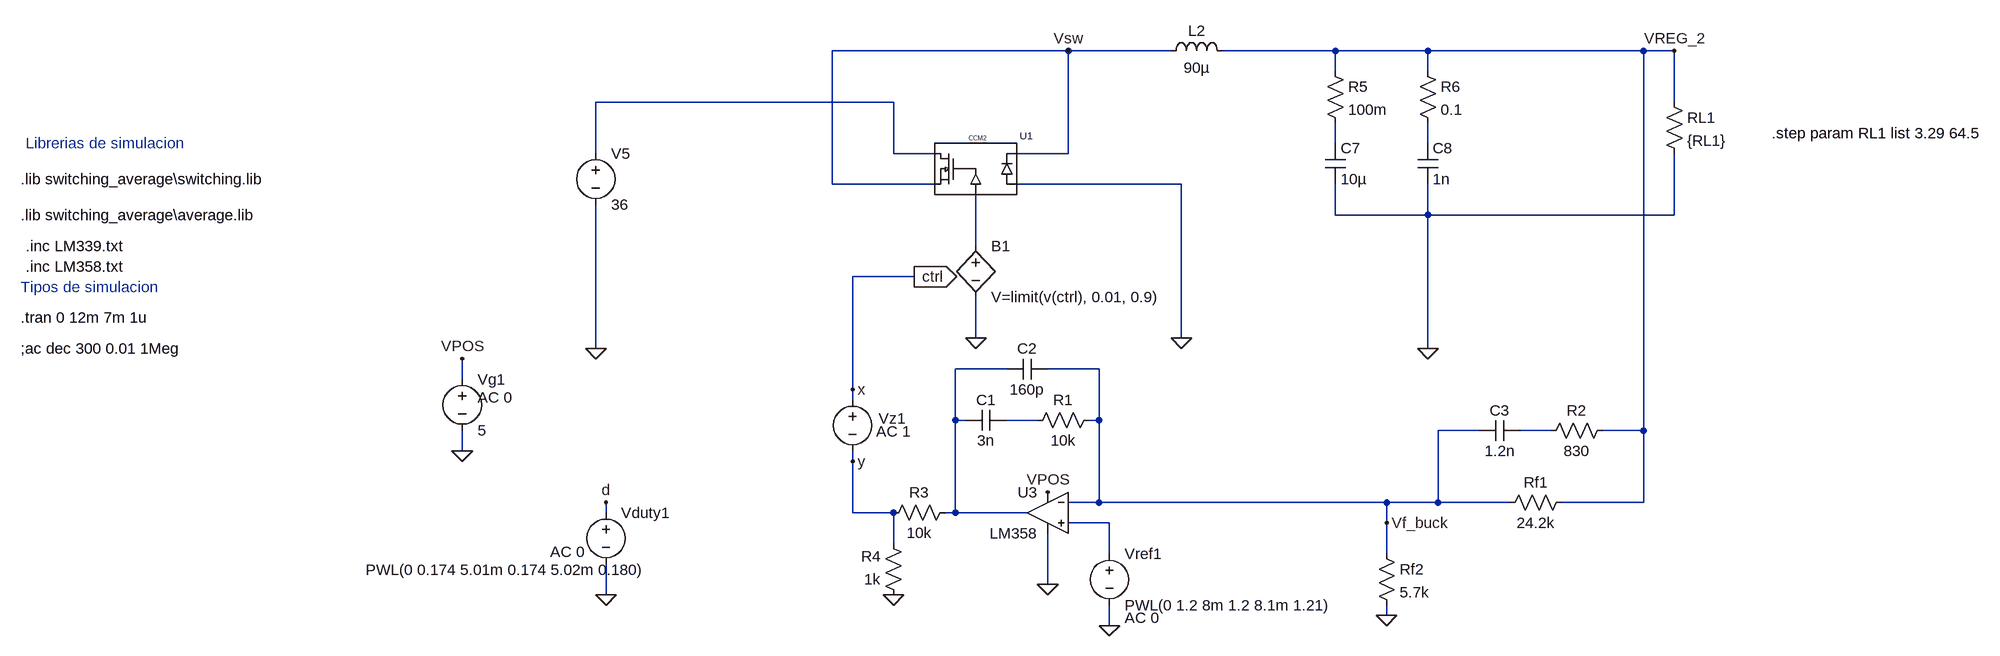
[diagram p0: schematic BUCK_v4_average.asc]
BUCK_v4_average.asc, the LTspice schematic file:
Version 4
SHEET 1 1932 1700
WIRE -688 576 -1056 576
WIRE -528 576 -688 576
WIRE -272 576 -448 576
WIRE -128 576 -272 576
WIRE 208 576 -128 576
WIRE 256 576 208 576
WIRE -272 608 -272 576
WIRE -128 608 -128 576
WIRE -960 656 -1424 656
WIRE 256 656 256 576
WIRE -272 720 -272 688
WIRE -128 720 -128 688
WIRE -1424 736 -1424 656
WIRE -960 736 -960 656
WIRE -896 736 -960 736
WIRE -688 736 -688 576
WIRE -688 736 -768 736
WIRE -1056 784 -1056 576
WIRE -896 784 -1056 784
WIRE -512 784 -768 784
WIRE -272 832 -272 784
WIRE -128 832 -128 784
WIRE -128 832 -272 832
WIRE 256 832 256 736
WIRE 256 832 -128 832
WIRE -832 880 -832 800
WIRE -928 928 -1024 928
WIRE -832 1024 -832 960
WIRE -512 1024 -512 784
WIRE -1424 1040 -1424 816
WIRE -128 1040 -128 832
WIRE -784 1072 -864 1072
WIRE -640 1072 -720 1072
WIRE -1632 1088 -1632 1056
WIRE -1024 1104 -1024 928
WIRE -1024 1120 -1024 1104
WIRE -864 1152 -864 1072
WIRE -848 1152 -864 1152
WIRE -736 1152 -784 1152
WIRE -640 1152 -640 1072
WIRE -640 1152 -656 1152
WIRE -48 1168 -112 1168
WIRE 64 1168 16 1168
WIRE 208 1168 208 576
WIRE 208 1168 144 1168
WIRE -1632 1200 -1632 1168
WIRE -1024 1216 -1024 1200
WIRE -640 1280 -640 1152
WIRE -640 1280 -688 1280
WIRE -192 1280 -640 1280
WIRE -112 1280 -112 1168
WIRE -112 1280 -192 1280
WIRE 0 1280 -112 1280
WIRE 208 1280 208 1168
WIRE 208 1280 80 1280
WIRE -1408 1296 -1408 1280
WIRE -1024 1296 -1024 1216
WIRE -960 1296 -1024 1296
WIRE -864 1296 -864 1152
WIRE -864 1296 -880 1296
WIRE -752 1296 -864 1296
WIRE -624 1312 -688 1312
WIRE -192 1312 -192 1280
WIRE -960 1344 -960 1296
WIRE -624 1360 -624 1312
WIRE -192 1360 -192 1312
WIRE -720 1408 -720 1328
WIRE -1408 1424 -1408 1376
WIRE -192 1456 -192 1440
WIRE -624 1472 -624 1440
FLAG -1408 1424 0
FLAG -1408 1280 d
FLAG -1424 1040 0
FLAG 256 576 VREG_2
FLAG -512 1024 0
FLAG -128 1040 0
FLAG -688 576 Vsw
FLAG -192 1456 0
FLAG -720 1408 0
FLAG -624 1472 0
FLAG -832 1024 0
FLAG -928 928 ctrl
IOPIN -928 928 Out
FLAG -1024 1104 x
FLAG -1024 1216 y
FLAG -192 1312 Vf_buck
FLAG -1632 1200 0
FLAG -720 1264 VPOS
FLAG -1632 1056 VPOS
FLAG -960 1424 0
SYMBOL voltage -1408 1280 R0
WINDOW 3 -374 105 Left 2
WINDOW 123 -87 77 Left 2
WINDOW 39 0 0 Left 2
SYMATTR Value PWL(0 0.174 5.01m 0.174 5.02m 0.180)
SYMATTR Value2 AC 0
SYMATTR InstName Vduty1
SYMBOL voltage -1424 720 R0
WINDOW 123 0 0 Left 0
WINDOW 39 0 0 Left 0
SYMATTR InstName V5
SYMATTR Value 36
SYMBOL ind -544 592 R270
WINDOW 0 32 56 VTop 2
WINDOW 3 5 56 VBottom 2
SYMATTR InstName L2
SYMATTR Value 90µ
SYMBOL cap -288 720 R0
SYMATTR InstName C7
SYMATTR Value 10µ
SYMBOL cap -144 720 R0
SYMATTR InstName C8
SYMATTR Value 1n
SYMBOL res 240 640 R0
SYMATTR InstName RL1
SYMATTR Value {RL1}
SYMBOL res -288 592 R0
SYMATTR InstName R5
SYMATTR Value 100m
SYMBOL res -144 592 R0
SYMATTR InstName R6
SYMATTR Value 0.1
SYMBOL res 96 1264 R90
WINDOW 0 0 56 VBottom 2
WINDOW 3 32 56 VTop 2
SYMATTR InstName Rf1
SYMATTR Value 24.2k
SYMBOL res -208 1344 R0
SYMATTR InstName Rf2
SYMATTR Value 5.7k
SYMBOL voltage -624 1344 R0
WINDOW 123 24 116 Left 2
WINDOW 39 0 0 Left 2
SYMATTR Value2 AC 0
SYMATTR InstName Vref1
SYMATTR Value PWL(0 1.2 8m 1.2 8.1m 1.21)
SYMBOL bv -832 864 R0
SYMATTR InstName B1
SYMATTR Value V=limit(v(ctrl), 0.01, 0.9)
SYMBOL voltage -1024 1104 R0
WINDOW 0 41 45 Left 2
WINDOW 123 37 65 Left 2
WINDOW 39 0 0 Left 2
SYMATTR InstName Vz1
SYMATTR Value2 AC 1
SYMATTR Value ""
SYMBOL voltage -1632 1072 R0
WINDOW 123 24 44 Left 2
WINDOW 39 0 0 Left 0
SYMATTR Value2 AC 0
SYMATTR InstName Vg1
SYMATTR Value 5
SYMBOL Opamps\\opamp2 -720 1232 M0
SYMATTR InstName U3
SYMATTR Value LM358
SYMBOL cap -720 1056 R90
WINDOW 0 0 32 VBottom 2
WINDOW 3 32 32 VTop 2
SYMATTR InstName C2
SYMATTR Value 160p
SYMBOL cap -784 1136 R90
WINDOW 0 0 32 VBottom 2
WINDOW 3 32 32 VTop 2
SYMATTR InstName C1
SYMATTR Value 3n
SYMBOL res -640 1136 R90
WINDOW 0 0 56 VBottom 2
WINDOW 3 32 56 VTop 2
SYMATTR InstName R1
SYMATTR Value 10k
SYMBOL cap 16 1152 R90
WINDOW 0 0 32 VBottom 2
WINDOW 3 32 32 VTop 2
SYMATTR InstName C3
SYMATTR Value 1.2n
SYMBOL res 160 1152 R90
WINDOW 0 0 56 VBottom 2
WINDOW 3 32 56 VTop 2
SYMATTR InstName R2
SYMATTR Value 830
SYMBOL res -864 1280 R90
WINDOW 0 0 56 VBottom 2
WINDOW 3 32 56 VTop 2
SYMATTR InstName R3
SYMATTR Value 10k
SYMBOL res -944 1440 R180
WINDOW 0 36 76 Left 2
WINDOW 3 36 40 Left 2
SYMATTR InstName R4
SYMATTR Value 1k
SYMBOL ccm1 -832 768 R0
SYMATTR InstName U1
SYMATTR Value CCM2
SYMATTR SpiceLine Ron=0.16
SYMATTR SpiceLine2 VD=0 RD=0.16
TEXT -2320 776 Left 2 !.lib switching_average\\switching.lib
TEXT -2320 832 Left 2 !.lib switching_average\\average.lib
TEXT -2312 720 Left 2 ;Librerias de simulacion
TEXT -2320 992 Left 2 !.tran 0 12m 7m 1u
TEXT -2320 1040 Left 2 !;ac dec 300 0.01 1Meg
TEXT -2320 944 Left 2 ;Tipos de simulacion
TEXT -2312 880 Left 2 !.inc LM339.txt
TEXT -2312 912 Left 2 !.inc LM358.txt
TEXT 408 704 Left 2 !.step param RL1 list 3.29 64.5

The netlist it stands for:
* BUCK_v4_average.asc
Vduty1 d 0 PWL(0 0.174 5.01m 0.174 5.02m 0.180) AC 0
V5 N001 0 36
L2 Vsw VREG_2 90µ
C7 N002 0 10µ
C8 N003 0 1n
RL1 VREG_2 0 {RL1}
R5 VREG_2 N002 100m
R6 VREG_2 N003 0.1
Rf1 VREG_2 Vf_buck 24.2k
Rf2 Vf_buck 0 5.7k
Vref1 N008 0 PWL(0 1.2 8m 1.2 8.1m 1.21) AC 0
B1 N004 0 V=limit(v(ctrl), 0.01, 0.9)
Vz1 x y AC 1
Vg1 VPOS 0 5 AC 0
XU3 N008 Vf_buck VPOS 0 N005 LM358  ; pins In+ In- V+ V- OUT
C2 Vf_buck N005 160p
C1 N006 N005 3n
R1 Vf_buck N006 10k
C3 N007 Vf_buck 1.2n
R2 VREG_2 N007 830
R3 N005 y 10k
R4 0 y 1k
XU1 N001 Vsw Vsw 0 N004 CCM2 Ron=0.16 VD=0 RD=0.16  ; pins 1 2 3 4 5
.lib switching_average\switching.lib
.lib switching_average\average.lib
* Librerias de simulacion
.tran 0 12m 7m 1u
;ac dec 300 0.01 1Meg
* Tipos de simulacion
.inc LM339.txt
.inc LM358.txt
.step param RL1 list 3.29 64.5
.backanno
.end